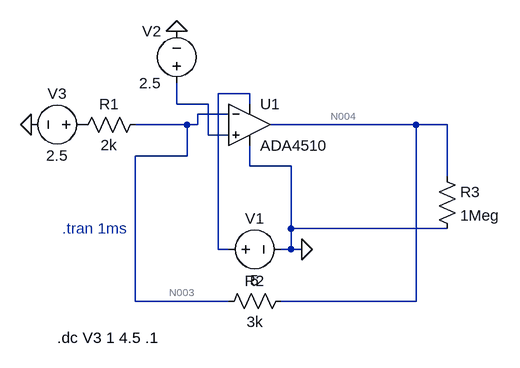
[diagram p0: schematic Simulation.asc]
Simulation.asc, the LTspice schematic file:
Version 4.1
SHEET 1 880 680
WIRE 336 96 288 96
WIRE 224 112 224 80
WIRE 272 112 224 112
WIRE 336 112 336 96
WIRE 304 128 256 128
WIRE 240 144 160 144
WIRE 256 144 256 128
WIRE 256 144 240 144
WIRE 592 144 368 144
WIRE 640 144 592 144
WIRE 272 160 272 112
WIRE 304 160 272 160
WIRE 240 192 240 144
WIRE 240 192 160 192
WIRE 336 208 336 176
WIRE 400 208 336 208
WIRE 640 224 640 144
WIRE 400 304 400 208
WIRE 640 304 400 304
WIRE 288 336 288 96
WIRE 304 336 288 336
WIRE 400 336 400 304
WIRE 400 336 384 336
WIRE 416 336 400 336
WIRE 160 416 160 192
WIRE 304 416 160 416
WIRE 592 416 592 144
WIRE 592 416 384 416
FLAG 224 0 0
FLAG 0 144 0
FLAG 416 336 0
SYMBOL voltage 288 336 R270
WINDOW 0 32 56 VTop 2
WINDOW 3 -32 56 VBottom 2
WINDOW 123 0 0 Left 0
WINDOW 39 0 0 Left 0
SYMATTR InstName V1
SYMATTR Value 5
SYMBOL voltage 224 96 R180
WINDOW 0 24 96 Left 2
WINDOW 3 24 16 Left 2
WINDOW 123 0 0 Left 0
WINDOW 39 0 0 Left 0
SYMATTR InstName V2
SYMATTR Value 2.5
SYMBOL voltage 96 144 R90
WINDOW 0 -32 56 VBottom 2
WINDOW 3 32 56 VTop 2
WINDOW 123 0 0 Left 0
WINDOW 39 0 0 Left 0
SYMATTR InstName V3
SYMATTR Value 2.5
SYMBOL res 176 128 R90
WINDOW 0 0 56 VBottom 2
WINDOW 3 32 56 VTop 2
SYMATTR InstName R1
SYMATTR Value 2k
SYMBOL res 400 400 R90
WINDOW 0 0 56 VBottom 2
WINDOW 3 32 56 VTop 2
SYMATTR InstName R2
SYMATTR Value 3k
SYMBOL OpAmps\\ADA4510 336 80 R0
SYMATTR InstName U1
SYMBOL res 624 208 R0
SYMATTR InstName R3
SYMATTR Value 1Meg
TEXT 40 472 Left 2 !.dc V3 1 4.5 .1
TEXT 48 304 Left 2 ;.tran 1ms

The netlist it stands for:
* Simulation.asc
V1 N001 0 5
V2 N002 0 2.5
V3 P001 0 2.5
R1 N003 P001 2k
R2 N004 N003 3k
X§U1 N002 N003 N001 0 N004 ADA4510  ; pins In+ In- V+ V- OUT
R3 N004 0 1Meg
.dc V3 1 4.5 .1
* .tran 1ms
.backanno
.end

* Results of the author's LTspice run, read from the files saved beside the schematic
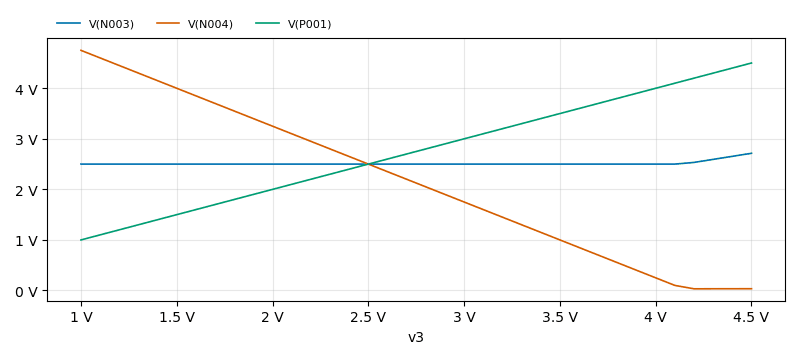
[diagram p1: DC transfer characteristic of Simulation.asc, plotted from the saved traces]
* DC transfer characteristic, 1 run:
*   V(N003): 2.5 V at v3=1 V, 2.714 V at v3=4.5 V, min 2.5 V, max 2.714 V
*   V(N004): 4.75 V at v3=1 V, 34.63 mV at v3=4.5 V, min 33.01 mV, max 4.75 V
*   V(P001): 1 V at v3=1 V, 4.5 V at v3=4.5 V, min 1 V, max 4.5 V